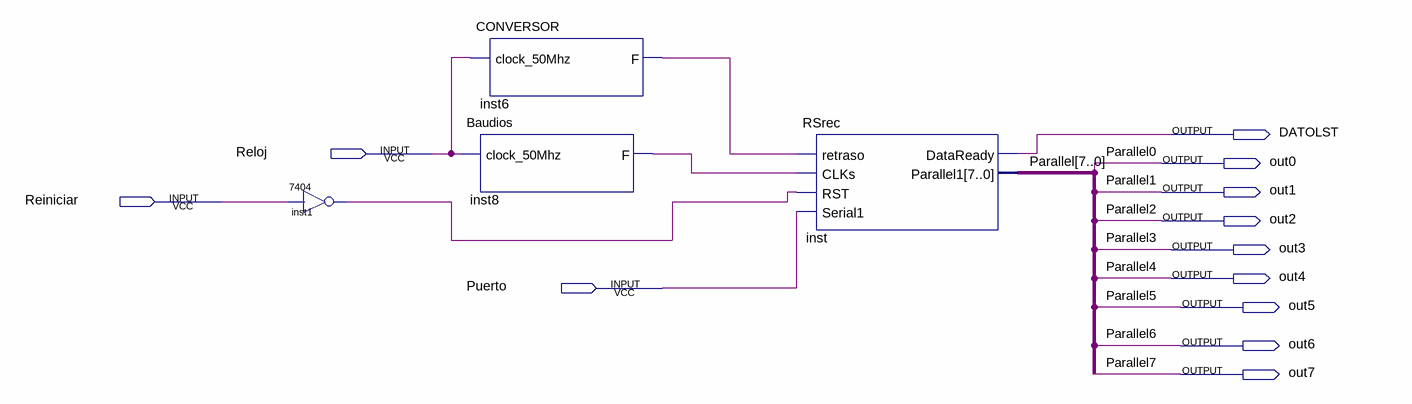
[diagram p0: schematic sheet]
// Quartus schematic RS.bdf as structural Verilog: 4 symbols, 12 pins
module RS (
  input  Reloj,
  input  Reiniciar,
  input  Puerto,
  output DATOLST,
  output out0,
  output out1,
  output out2,
  output out3,
  output out4,
  output out5,
  output out6,
  output out7
);

  wire inst1_1, inst6_f, inst8_f;

  \7404  inst1 (.\2 (Reiniciar), .\1 (inst1_1));
  Baudios inst8 (.clock_50Mhz(Reloj), .F(inst8_f));
  CONVERSOR inst6 (.clock_50Mhz(Reloj), .F(inst6_f));
  RSrec inst (
    .retraso(inst6_f), .CLKs(inst8_f), .RST(inst1_1), .Serial1(Puerto),
    .Parallel1({out7, out6, out5, out4, out3, out2, out1, out0}), .DataReady(DATOLST));

  // Other names for the same wires on the sheet: Parallel[7:0] = {out7, out6, out5, out4, out3, out2, out1, out0};
  //   Parallel0 = out0; Parallel1 = out1; Parallel2 = out2; Parallel3 = out3; Parallel4 = out4; Parallel5 = out5;
  //   Parallel6 = out6; Parallel7 = out7
endmodule
